# Altium project PCB_Project.PrjPcb
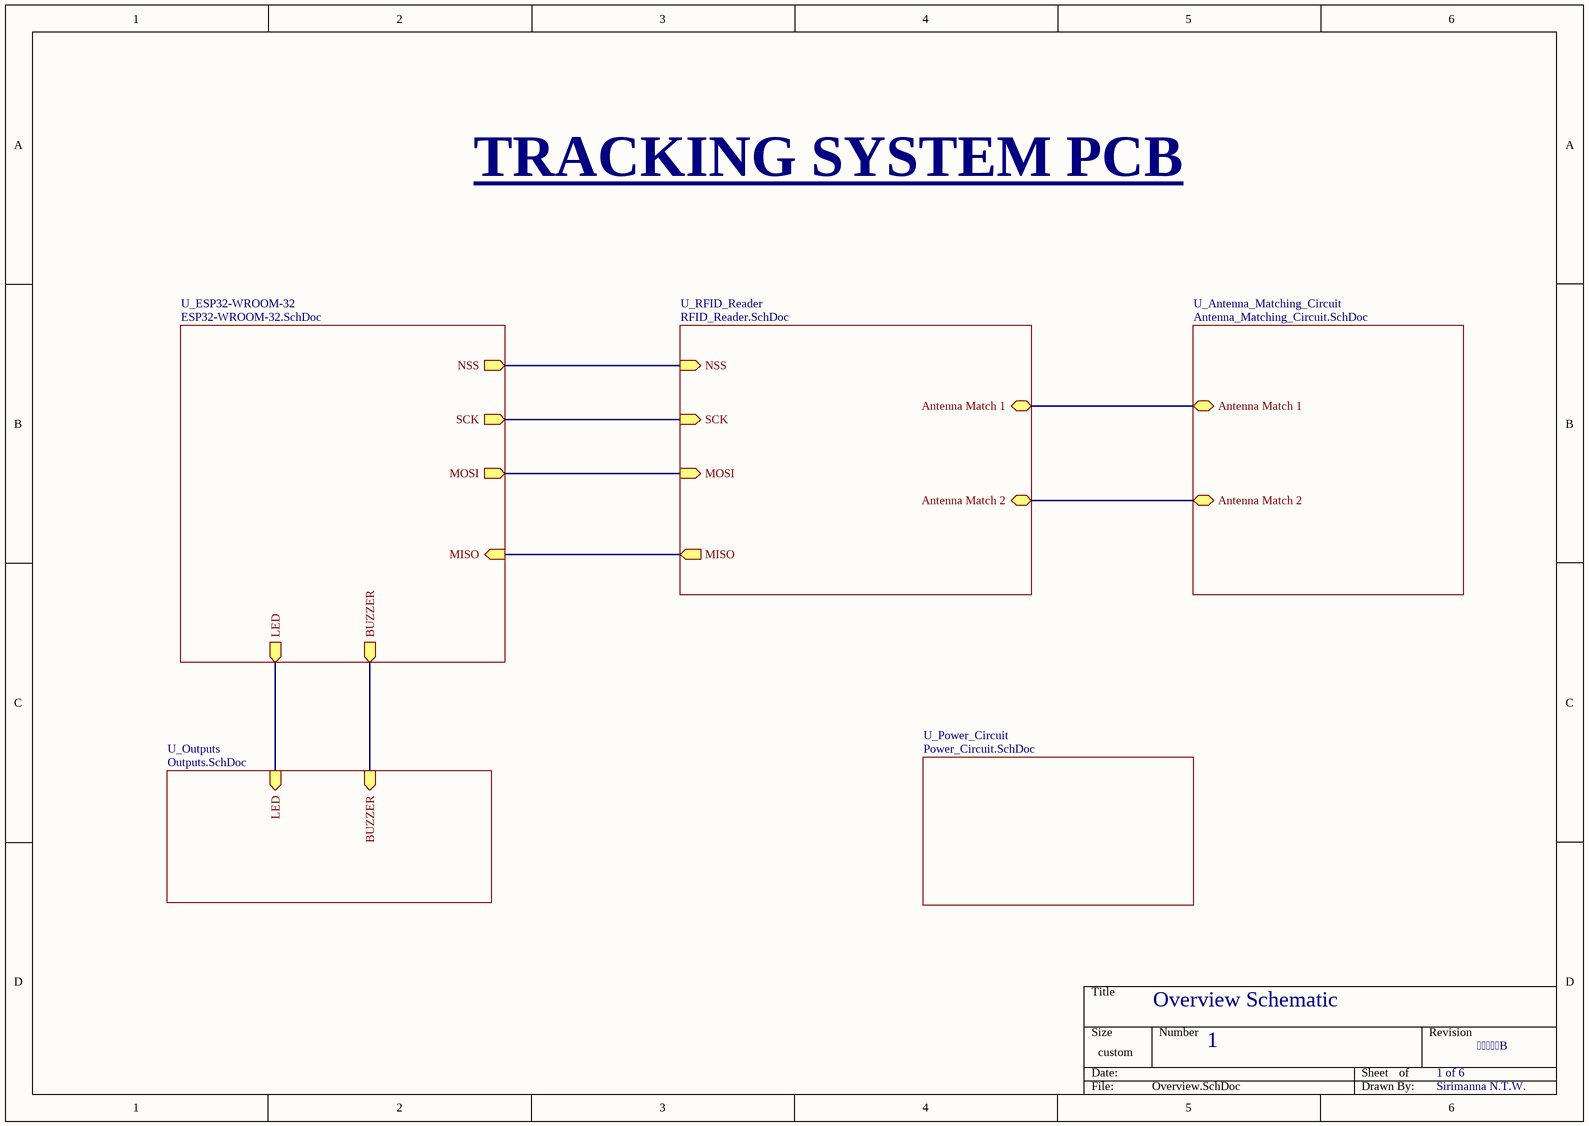
[diagram p0: Overview.SchDoc]
6 sheets, 73 parts. Net scope: hierarchical (ports join the sheet entries above them; power ports are global).
Board file: RFID_withESP32_PCB.PcbDoc
Sheets:
  Overview.SchDoc
    U_Power_Circuit = Power_Circuit.SchDoc
    U_ESP32-WROOM-32 = ESP32-WROOM-32.SchDoc
    U_Outputs = Outputs.SchDoc
    U_RFID_Reader = RFID_Reader.SchDoc
    U_Antenna_Matching_Circuit = Antenna_Matching_Circuit.SchDoc

## Sheet Overview.SchDoc
size 297 x 209 mm; SheetNumber: 1; SheetTotal: 6

### Sub-sheets
U_Antenna_Matching_Circuit = Antenna_Matching_Circuit.SchDoc: Antenna Match 1 (bidir), Antenna Match 2 (bidir)
U_ESP32-WROOM-32 = ESP32-WROOM-32.SchDoc: SCK (out), MISO (in), MOSI (out), NSS (out), BUZZER (out), LED (out)
U_Outputs = Outputs.SchDoc: BUZZER (in), LED (in)
U_Power_Circuit = Power_Circuit.SchDoc: no entries
U_RFID_Reader = RFID_Reader.SchDoc: Antenna Match 1 (bidir), Antenna Match 2 (bidir), NSS (in), SCK (in), MOSI (in), MISO (out)

### Nets
NetC20_1: sheet U_RFID_Reader/Antenna Match 1, sheet U_Antenna_Matching_Circuit/Antenna Match 1
NetC25_1: sheet U_RFID_Reader/Antenna Match 2, sheet U_Antenna_Matching_Circuit/Antenna Match 2
NetD3_2: sheet U_ESP32-WROOM-32/LED, sheet U_Outputs/LED
NetMD1_13: sheet U_ESP32-WROOM-32/BUZZER, sheet U_Outputs/BUZZER
NetMD1_29: sheet U_ESP32-WROOM-32/NSS, sheet U_RFID_Reader/NSS
NetMD1_30: sheet U_ESP32-WROOM-32/SCK, sheet U_RFID_Reader/SCK
NetMD1_31: sheet U_ESP32-WROOM-32/MISO, sheet U_RFID_Reader/MISO
NetMD1_37: sheet U_ESP32-WROOM-32/MOSI, sheet U_RFID_Reader/MOSI

### Notes on the sheet
- TRACKING SYSTEM PCB
- Overview Schematic
- 1
- 1 of 6
- B
- Sirimanna N.T.W.

## Sheet Power_Circuit.SchDoc
size 297 x 209 mm; SheetNumber: 2; SheetTotal: 6
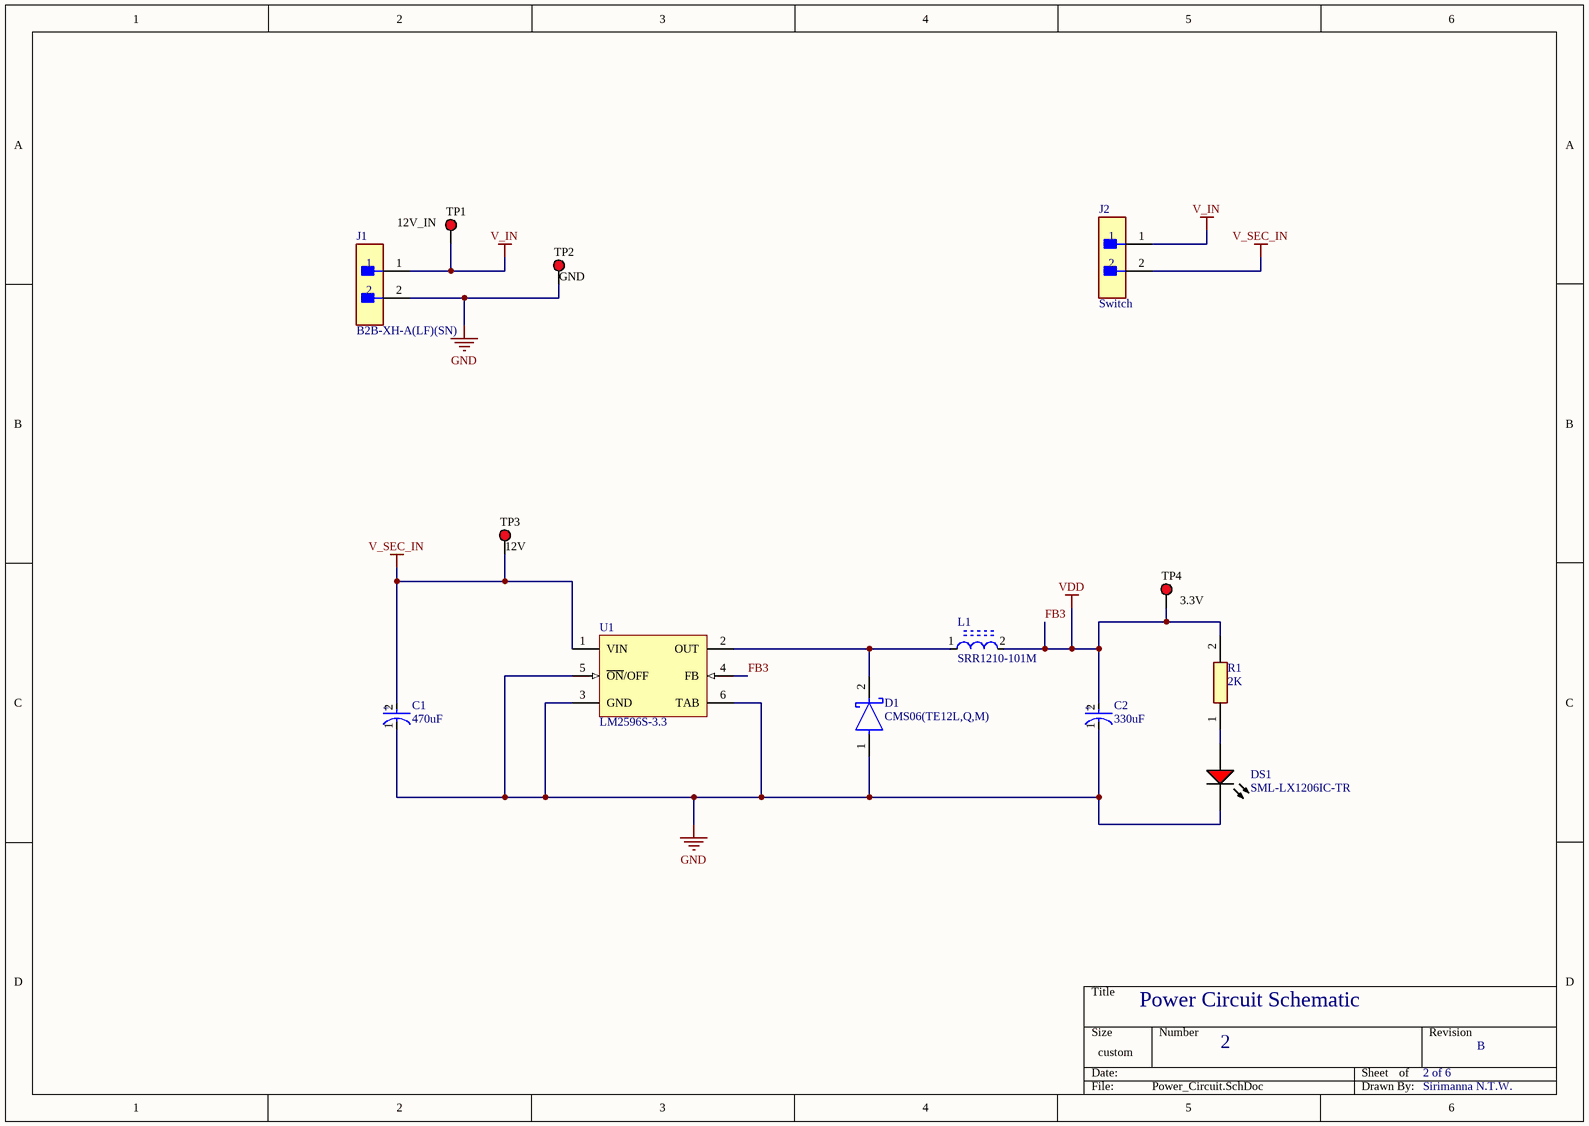
[diagram p1: Power_Circuit.SchDoc]

### Parts
C1  470uF  [FP-ZAG-MFG]
C2  330uF  [FP-FKG-MFG]
D1  CMS06(TE12L,Q,M)  [FP-M-FLAT-MFG]
DS1  SML-LX1206IC-TR  [LUMX-SML-LX1206IC_V]
J1  B2B-XH-A(LF)(SN)  [FP-B2B-XH-A_LF_SN-MFG]
J2  Switch  [FP-B2B-XH-A_LF_SN-MFG]
L1  SRR1210-101M  [FP-SRR1210-MFG]
R1  2K  [RESC3216X75N]
TP1  12V_IN  [KSTN-5010_V]
TP2  GND  [KSTN-5010_V]
TP3  12V  [KSTN-5010_V]
TP4  3.3V  [KSTN-5010_V]
U1  LM2596S-3.3  [KTT0005B_N]

### Nets
FB3: C2.2(A) L1.2 R1.2 TP4.1 U1.4(FB)  [also labelled VDD]
GND: C1.1(C) C2.1(C) D1.1(A) DS1.2(K) J1.2 TP2.1 U1.3(GND) U1.5(~{ON}/OFF) U1.6(TAB)
V_IN: J1.1 J2.1 TP1.1
V_SEC_IN: C1.2(A) J2.2 TP3.1 U1.1(VIN)
NetD1_2: D1.2(C) L1.1 U1.2(OUT)
NetDS1_1: DS1.1(A) R1.1

### Notes on the sheet
- Power Circuit Schematic
- 2
- 2 of 6
- B
- Sirimanna N.T.W.
- (in symbol CMP-2000-06221-2) +
- (in symbol CMP-05427-002115-1) +

### Library data of the parts
C1 = CMP-2000-06221-2: CAP ALUM POLY HYB 100UF 50V SMD; Manufacturer: Panasonic; Manufacturer Part Number: EEHZA1H101P; Material: Conductive Polymer; Tolerance: 20%; Dissipation Factor: 10%; Ripple Current: 2000mA; Life: 10000Hours; Esr: 28mΩ; Automotive Grade: Grade 2; Leakage Current: 50uA; Mouser Description: Cap Aluminum Polymer Hybrid 100uF 50VDC 20% (10 X 10.2mm) SMD 0.028 Ohm 2000mA 10000h 105C Embossed T/R; Automotive: Yes; Device Class L1: Passive Components; Voltage: 50V; Voltage Rating: 50V; ComponentLink2URL: https://industrial.panasonic.com/cdbs/www-data/pdf/RDD0000/ABA0000C1221.pdf; Mounting Type: Surface Mount; ComponentLink2Description: Datasheet; Temperature: -55°C to +105°C; RoHS: TRUE; Package: ZAG; Digikey Description: CAP ALUM POLY HYB 100UF 50V SMD; Temperature Range High: +105°C; Category: Cap; Height: 10.5mm; Value: 100uF; Device Class L2: Capacitors; Capacitance: 100uF; Lead Free: Yes; Temperature Range Low: -55°C; Footprint Url: https://industrial.panasonic.com/cdbs/www-data/pdf/RDD0000/DMD0000COL4.pdf; Device Class L3: Polymer Capacitors; Octopart: https://octopart.com/eeh-za1h101p-panasonic-22287466
C2 = CMP-05427-002115-1: CAP ALUM 330UF 20% 35V SMD; ESR (Equivalent Series Resistance): 80mR; Ripple Current: 850mA; Dielectric Material: Aluminium; Lead Length: 3.5mm; Life (Hours): 2000Hour; Leakage Current: 115.5uA; Length: 10.2mm; Construction: Cylindrical; Package Quantity: 500; Termination: SMD/SMT; RoHS Compliant: Yes; Impedance: 80mR; Width: 10.3mm; Height - Seated (Max): 0.402inch; Voltage: 35V; Voltage Rating: 35V; Diameter: 10mm; Contact Plating: Tin; Number of Pins: 2; Capacitance: 330uF; Case/Package: Radial; Reach SVHC Compliant: Yes; Lead Free: Lead Free; Series: FK; Ripple Current (AC): 850mA; Tolerance: 20%; Ratings: AEC-Q200; Lead Pitch: 4.6mm; Mount: Surface Mount; Height: 10.2mm; Max Operating Temperature: 105°C; Packaging: Tape and Reel; Min Operating Temperature: -55°C; Voltage Rating (DC): 35V; Radiation Hardening: No
D1 = CMP-2000-06115-2: DIODE SCHOTTKY 30V 2A MFLAT; Forward Voltage: 370mV; Peak Non-Repetitive Surge Current: 40A; Max Reverse Leakage Current: 3mA; Element Configuration: Single; Package Quantity: 1; Max Operating Temperature: 125°C; Mount: Surface Mount; Max Repetitive Reverse Voltage (Vrrm): 30V; Forward Current: 2A; Number of Pins: 2; Min Operating Temperature: -40°C; Radiation Hardening: No; Average Rectified Current: 2A; Contact Plating: Tin; Max Reverse Voltage (DC): 30V; Peak Reverse Current: 3mA; Max Surge Current: 40A; Packaging: Tape and Reel
DS1 = CMP-2000-07123-1: LED Red, 65 mW, -40 to 85 degC, 2-Pin SMD, RoHS, Tape and Reel; Manufacturer: Lumex; LED Material: GaAsP; Peak Wavelength: 635nm; Number of LEDs: 1; Viewing Angle: 160; Reverse Voltage: 5(Min)V; Lens Appearance: ColorlessNonDiffused; Intensity: 6mcd; Type: Uni-Color; Pin_Count: 2; Lens Dimensions: 2x1.6x0.5mm; Mounting: SurfaceMount; ECCN: EAR99; RoHS: Unknown; Package Description: 2-Pin Surface Mount Device, Body 3.2 x 1.5 mm; Mounting Technology: SurfaceMount; Dominant Wavelength: N/A; Supplier_Package: SMD; Supplier Standard Pack: 3,000; Color: Red; Dimension: 3.2x1.6x1.1mm; HTS: 8541402000; Part No: SML-LX1206IC-TR; Family: SML-LX1206IC; Supplier: Lumex; Datasheet URL: http://www.lumex.com/content/files/ProductAttachment/SML-LX1206IC-TR.pdf; Package Reference: SML-LX1206IC; Manufacturer URL: http://www.lumexinstruments.com/; Operating Temperature: -25to85C; Packaging: TapeandReel; Datasheet Version: Rev. J, 08/2012
J1 = CMP-2000-05888-3: CONN HEADER VERT 2POS 2.5MM; Current Rating: 3A; Voltage Rating: 250V; Number of Contacts: 2; Contact Resistance: 20mR; Wire/Cable Gauge: 22AWG; Insulation Resistance: 1GR; Connector Type: Male Pin; Packaging: Bulk; Contact Material: Brass; Lead Free: Lead Free; Orientation: Straight; Contact Plating: Tin; Max Current Rating: 3A; Termination: Solder; Fastening Type: Detent; Depth: 5.75mm; Housing Material: Polyamide; REACH SVHC: No SVHC; Series: XH; Voltage Rating (AC): 250V; Number of Positions: 2; Color: Natural; Contact Type: Male Pin; Max Voltage Rating (DC): 250V; Pitch: 2.5mm; Lead Pitch: 2.5mm; Mount: Through Hole; Max Operating Temperature: 85°C; Length: 7.4mm; Max Voltage Rating (AC): 250V; Min Operating Temperature: -25°C; Number of Rows: 1; Housing Color: White
J2 = CMP-2000-05888-3: To power Switch; Current Rating: 3A; Voltage Rating: 250V; Number of Contacts: 2; Contact Resistance: 20mR; Wire/Cable Gauge: 22AWG; Insulation Resistance: 1GR; Pitch: 2.5mm; Connector Type: Male Pin; Packaging: Bulk; Contact Material: Brass; Lead Free: Lead Free; Orientation: Straight; Contact Plating: Tin; Max Current Rating: 3A; Termination: Solder; Fastening Type: Detent; Depth: 5.75mm; Housing Material: Polyamide; REACH SVHC: No SVHC; Series: XH; Voltage Rating (AC): 250V; Number of Positions: 2; Color: Natural; Contact Type: Male Pin; Max Voltage Rating (DC): 250V; Lead Pitch: 2.5mm; Mount: Through Hole; Max Operating Temperature: 85°C; Length: 7.4mm; Max Voltage Rating (AC): 250V; Min Operating Temperature: -25°C; Number of Rows: 1; Housing Color: White
L1 = CMP-07248-000065-1: FIXED IND 100UH 2.5A 135MOHM SMD; Shielding: Shielded; DC Resistance (DCR): 135mR; Core Material: Ferrite; Inductance Tolerance: 20%; Saturation Current: 2.2A; Q Factor: 16; Self Resonant Frequency: 3MHz; Test Frequency: 100kHz; Height: 10mm; Width: 0.472inch; Mount: Surface Mount; Inductance: 100uH; RMS Current (Irms): 2.5A; Packaging: Tape and Reel; Max Operating Temperature: 125°C; Military Standard: Not; DC Current: 2.5A; Max DC Current: 2.5A; Length: 12mm; RoHS Compliant: Yes; Height - Seated (Max): 0.394inch; Resistor Type: Wirewound; Current Rating: 2.5A; REACH SVHC: No SVHC; Tolerance: 20%; Series: SRR1210; Package Quantity: 1; Min Operating Temperature: -40°C; Depth: 12.5mm; Case/Package: 1210; Termination: SMD/SMT
R1 = CR1206-FX-1022ELF: Resistor; Manufacturer_Name: Bourns; Datasheet Link: http://componentsearchengine.com/Datasheets/1/CR1206-FX-1022ELF.pdf; Height: 0.75mm; Manufacturer_Part_Number: CR1206-FX-1022ELF; Mouser Part Number: 652-CR1206FX-1022ELF; Mouser Price/Stock: https://www.mouser.co.uk/ProductDetail/Bourns/CR1206-FX-1022ELF?qs=3wWX5hyYeeRJQVfgTvfo2Q%3D%3D; Arrow Part Number: CR1206-FX-1022ELF; Arrow Price/Stock: https://www.arrow.com/en/products/cr1206-fx-1022elf/bourns
TP1-TP4 = CMP-1672-00002-4: Test Point, Red, Through Hole, RoHS, Bulk; Manufacturer: Keystone; Contact Material: Bronze; Mounting Technology: Through Hole; RoHSCompliant: true; Pins: 1; Package Quantity: 100; ComponentLink2Description: Datasheet; Height: 8.12 mm; ComponentLink1URL: http://www.keyelco.com/; DatasheetVersion: Rev. F, 12/2013; Mount: Through Hole; PackageReference: 5010; Contact Plating: Silver; Packaging: Bulk; Colour: Red; REACH SVHC: No SVHC; PackageDescription: 1-Pin Through Hole Device, Dia 3.17 mm; ComponentLink2URL: http://www.keyelco.com/product-pdf.cfm?p=1319; ComponentLink1Description: Manufacturer URL
U1 = CMP-0069-00276-3: SIMPLE SWITCHER® Power Converter 150 KHz 3A Step-Down Voltage Regulator, 5-pin TO-263; Manufacturer: Texas Instruments; PowerWise: N; PackageTopMarking: NSUZXYTTE#*LM2596S*-3.3 P+; ComponentLink1Description: Datasheet URL; RoHS: N; PackageDescription: TO-263, Molded, .400 x .390 x .180in, 5 Lead, .067in Pitch, Surface Mount; PackageReference: KTT0005B; Code_JEDEC: MO-169-AB; PinCount: 5; ComponentLink1URL: http://www.ti.com/general/docs/lit/getliterature.tsp?genericPartNumber=LM2596&fileType=pdf; CompType: Switcher

## Sheet ESP32-WROOM-32.SchDoc
size 297 x 209 mm; SheetNumber: 3; SheetTotal: 6
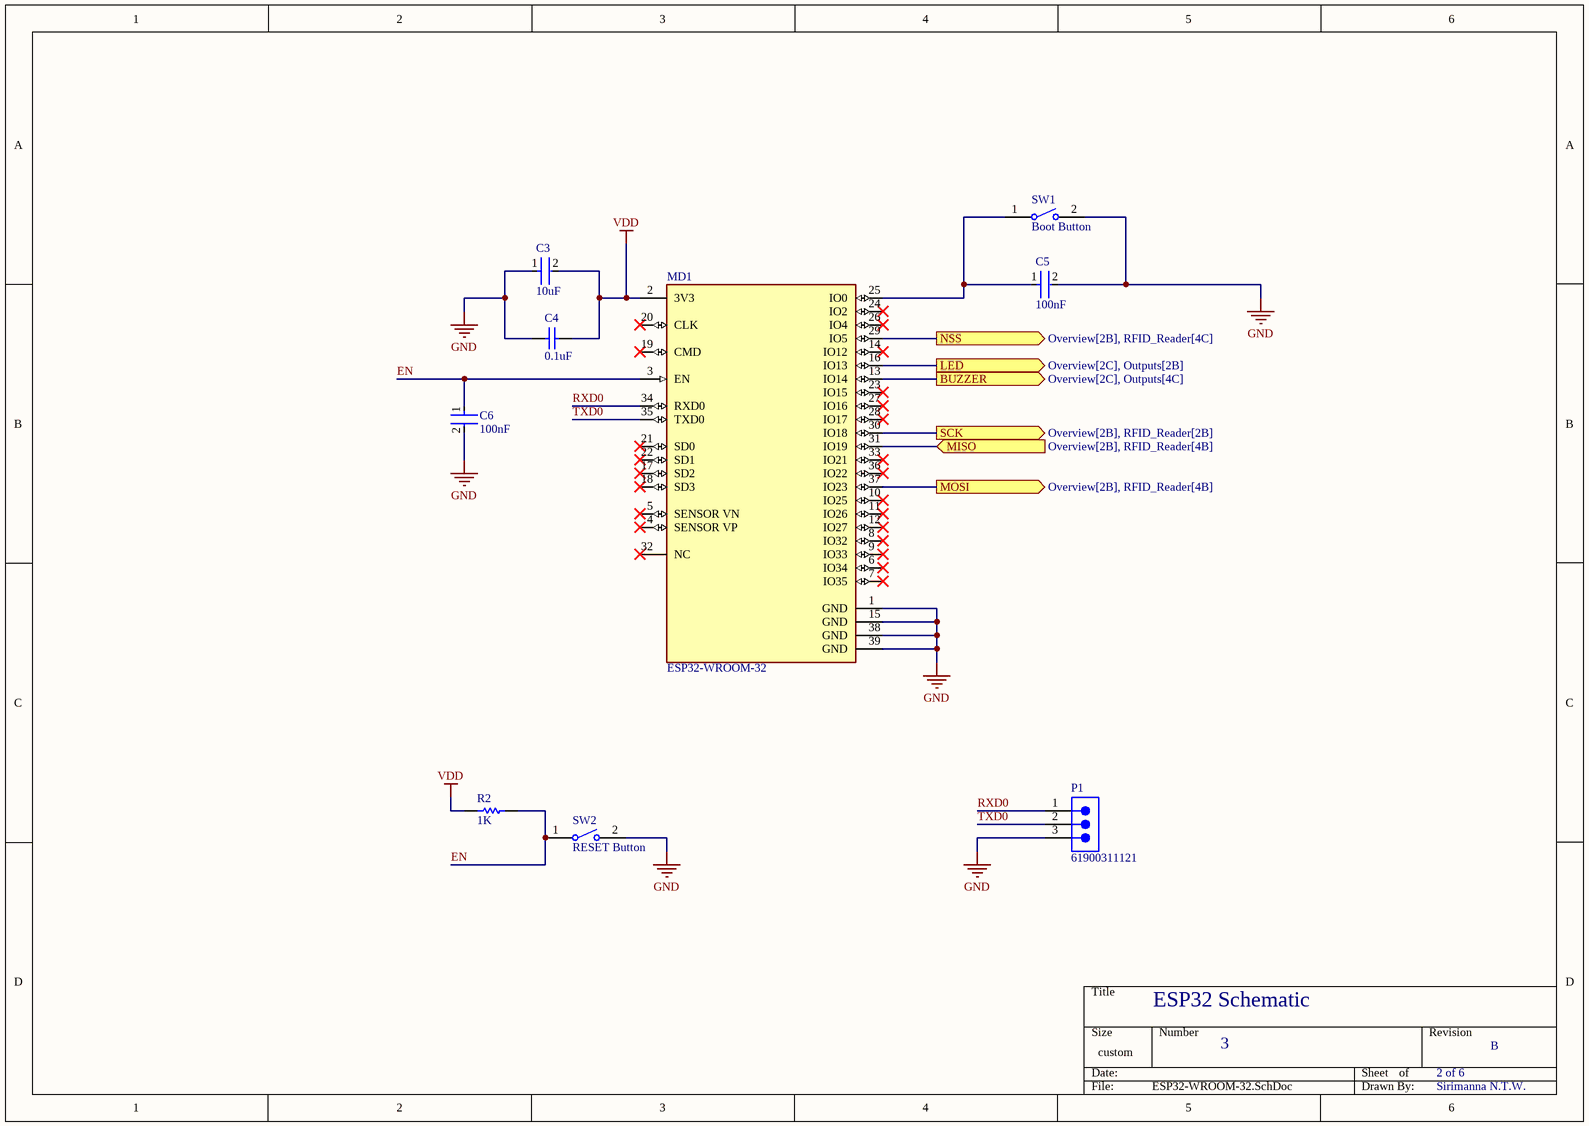
[diagram p2: ESP32-WROOM-32.SchDoc]

### Parts
C3  10uF  [FP-C0805C-DG-MFG]
C4  0.1uF  [CAPC2013X94X50ML20T25]
C5  100nF  [FP-CC0805-0_85-MFG]
C6  100nF  [FP-0805-L_2_01_0_2-W_1_25-IPC_B]
MD1  ESP32-WROOM-32  [FP-ESP32-WROOM-32-MFG]
P1  61900311121  [61900311121]
R2  1K  [RESC2013X60X35ML10T20]
SW1  Boot Button  [TECO-FSMSM-2_V]
SW2  RESET Button  [TECO-FSMSM-2_V]

### Ports
BUZZER (out, see Overview[2C], Outputs[4C]), LED (out, see Overview[2C], Outputs[2B]), MISO (in, see Overview[2B], RFID_Reader[4B]), MOSI (out, see Overview[2B], RFID_Reader[4B]), NSS (out, see Overview[2B], RFID_Reader[4C]), SCK (out, see Overview[2B], RFID_Reader[2B])

### Nets
GND: C3.1 C4.1 C5.2 C6.2 MD1.1(GND) MD1.15(GND) MD1.38(GND) MD1.39(GND) P1.3 SW1.2 SW2.2
VDD: C3.2 C4.2 MD1.2(3V3) R2.1  [project net FB3]
EN: C6.1 MD1.3(EN) R2.2 SW2.1
RXD0: MD1.34(RXD0) P1.1
TXD0: MD1.35(TXD0) P1.2
NetC5_1: C5.1 MD1.25(IO0) SW1.1
NetD3_2: MD1.16(IO13) ; port LED
NetMD1_13: MD1.13(IO14) ; port BUZZER
NetMD1_29: MD1.29(IO5) ; port NSS
NetMD1_30: MD1.30(IO18) ; port SCK
NetMD1_31: MD1.31(IO19) ; port MISO
NetMD1_37: MD1.37(IO23) ; port MOSI

Not connected (* = marked no-connect by the designer): MD1 4(SENSOR_VP)* 5(SENSOR_VN)* 6(IO34)* 7(IO35)* 8(IO32)* 9(IO33)* 10(IO25)* 11(IO26)* 12(IO27)* 14(IO12)* 17(SD2)* 18(SD3)* 19(CMD)* 20(CLK)* 21(SD0)* 22(SD1)* 23(IO15)* 24(IO2)* 26(IO4)* 27(IO16)* 28(IO17)* 32(NC)* 33(IO21)* 36(IO22)*

### Notes on the sheet
- ESP32 Schematic
- 3
- 2 of 6
- B
- Sirimanna N.T.W.

### Library data of the parts
C3 = CMP-2007-03243-2: CAP CER 10UF 10V X5R 0805; Manufacturer Part Number: C0805C106K8PACTU; Manufacturer: Kemet; 3DS Part Number: 220-00001; Tolerance: 10%; Temperature Coefficient: 15%; Material: Ceramic; Device Class L2: Capacitors; Device Class L1: Passive Components; ComponentLink2URL: https://content.kemet.com/datasheets/KEM_C1006_X5R_SMD.pdf; Height: 1.4mm; Lead Free: Yes; Digikey Description: CAP CER 10UF 10V X5R 0805; Octopart: https://octopart.com/c0805c106k8pactu-kemet-98697; Capacitance: 10uF; Value: 10uF; Temperature Range Low: -55°C; Temperature: -55°C to +85°C; Automotive: No; Mouser Description: CAP CER 10UF 10V X5R 0805; Ipc Land Pattern Name: CAPC200125X125; Temperature Range High: +85°C; Voltage: 10V; RoHS: TRUE; Device Class L3: Ceramic Capacitors; ComponentLink2Description: Datasheet; Voltage Rating: 10V; Package: C0805C-DG; Temperature Characteristic: X5R; Category: Cap
C4 = CMP-1036-04427-2: Manufacturer: AVX Interconnect / Elco; Part Number: 08051C104JAT2A
C5 = CMP-2100-03606-3: CAP CER 0.1UF 50V X7R 0805; Manufacturer Part Number: CC0805KRX7R9BB104; Manufacturer: Yageo; Tolerance: 0.1; Material: Ceramic; Device Class L1: Passive Components; ComponentLink2Description: Datasheet; Package: CC0805-0.85; Digikey Description: CAP CER 0.1UF 50V X7R 0805; Capacitance: 100 nF; Device Class L3: Ceramic Capacitors; Value: 100 nF; Temperature: -30°C to +85°C; Temperature Characteristic: X7R; Voltage Rating: 50 V; Height: 0.95mm; RoHS: TRUE; Ipc Land Pattern Name: CAPC200125X85; Device Class L2: Capacitors; Category: Cap; Temperature Range Low: -30°C; Temperature Range High: +85°C; Mouser Description: Multilayer Ceramic Capacitors MLCC - SMD/SMT 100nF 50V X7R 10%; Footprint Url: http://www.yageo.com/exep/pages/download/literatures/UPY-C_GEN_24.pdf; Automotive: No; Octopart: https://octopart.com/cc0805krx7r9bb104-yageo-192993; Lead Free: Yes; ComponentLink2URL: http://www.yageo.com/documents/recent/UPY-GPHC_Y5V_6.3V-to-50V_8.pdf
C6 = CMP-2007-04174-2: General Purpose Ceramic Capacitor, 0805, 100nF, 10%, X7R, 15%, 100V; Packaging: Tape and Reel; Min Operating Temperature: -55°C; Dielectric Material: Ceramic; Height: 1.4mm; Voltage Rating: 100V; Termination: SMD/SMT; Case Code (Imperial): 0805; Case Code (Metric): 2012; Case/Package: 0805; Construction: Flat; Radiation Hardening: No; Series: -; Dielectric: X7R; Package Quantity: 2000; Mount: Surface Mount; Capacitance: 100nF; Contact Plating: Tin; Voltage: 100V; Lead Free: Lead Free; Depth: 1.25mm; RoHS Compliant: Yes; Number of Pins: 2; Max Operating Temperature: 125°C; Length: 2.01mm; Voltage Rating (DC): 100V; Thickness: 0.055inch; REACH SVHC: No SVHC; Width: 0.049inch; Tolerance: 10%
MD1 = CMP-194065-000008-1: RX TXRX MOD WIFI SURFACE MOUNT; Frequency: 2.5GHz; Sensitivity: -98dBm; Operating Supply Voltage: 3.6V; Data Rate: 150Mbps; Weight: 0.088185oz; Package Quantity: 550; Min Operating Temperature: -40°C; Mount: Surface Mount; Max Operating Temperature: 85°C; Packaging: Cut Tape; Case/Package: SMD/SMT
P1 = CMP-1502-00585-2: NexarPartId: 18818222; Current Rating: 3A; Voltage Rating: 250V; Number of Positions: 3; Insulation Resistance: 1GΩ; Gender: Male; Pitch: 2.54mm; Connector Type: Male Pin; Contact Resistance: 20mΩ; Termination: Through Hole; Width: 7.66mm; Contact Plating: Tin; Orientation: Vertical; Mount: Through Hole; Contact Gender: Male; Max Operating Temperature: 105°C; Length: 7.62mm; Number of Rows: 1; Height: 12.5mm; Lead Pitch: 2.54mm; Housing Material: Nylon; Color: Beige; Contact Material: Copper; Fastening Type: Friction; Min Operating Temperature: -40°C; Number of Contacts: 3; Number of Pins: 3; Flammability Rating: UL94 V-0; Contact Mating Length: 7.493mm; RoHS: Compliant; REACH SVHC: Unknown; Packaging: Bulk; Operating Supply Voltage: 250V
R2 = CMP-2100-03671-1: Chip Resistor, 1 KOhm, +/- 1%, 125 mW, -55 to 155 degC, 0805 (2012 Metric), RoHS, Tape and Reel; Manufacturer: Yageo; Temperature Coefficient: 100ppm/degreesC; Voltage Rating (DC): 150V; Max Power Dissipation: 125mW; Resistance: 1KOhm; Number of Pins: 2; Number of Terminations: 2; Datasheet URL: http://www.yageo.com/NewPortal/yageodocoutput?fileName=/pdf/R-Chip/PYu-RC_Group_51_RoHS_L_5.pdf; Length: 0.079inch; Package Description: 2-Pin Surface Mounted Device, Body 2 x 1.25 mm; Depth: 1.25mm; Height: 0.024inch; Military Standard: Not; Case/Package: 0805; Package Reference: 0805; RoHSCompliant: true; Lead Free: LeadFree; Packaging: TapeandReel; Package Quantity: 1; Datasheet Version: Rev. 5, 10/2016; Tolerance: 1%; Min Operating Temperature: -55degC; Voltage Rating: 150V; Composition: ThickFilm; Case Code (Imperial): 0805; Power Rating: 125mW; Width: 0.049inch; Case Code (Metric): 2012; Manufacturer URL: http://www.yageo.com/; Max Operating Temperature: 155degC; REACH SVHC: Unknown; Termination: SMD/SMT
SW1 SW2 = CMP-2000-07511-1: FSMSM Push Button Switch, 50 mA, -35 to 85 degC, 2-Pin SMD, RoHS, Bulk; Manufacturer: TE Connectivity; Actuator Length: 1.07mm; Electrical Life: 20000Cycles; Actuator Material: Polyamide; Current Rating: 50mA; Illumination Type: Illuminated; Voltage Rating (DC): 24V; Contact Resistance: 100mOhm; Case\/Package: SMD/SMT; Operating Force: 180gf; Switch Travel: 0.25mm; Max Voltage Rating (DC): 12V; Throw Configuration: SPST; Packaging: LoosePiece; Max Operating Temperature: 85degC; ELV: Compliant; Package Description: 2-Pin Surface Mount Device, Body 6 x 3.5 mm, Pitch 9.19 mm; RoHSCompliant: true; Manufacturer URL: http://www.te.com/; Contact Plating: Silver; Contact Material: Brass; Mounting Technology: SurfaceMount; Contact Current Rating: 50mA; Datasheet Version: Rev. C2, 08/2014; Datasheet URL: http://www.te.com/commerce/DocumentDelivery/DDEController?Action=showdoc&DocId=Customer+Drawing%7F1437566-3%7FC2%7Fpdf%7FEnglish%7FENG_CD_1437566-3_C2_1437566_3_1_c.dwg.pdf%7F1437566-3; Mechanical Life: 20000Cycles; Package Reference: FSMSM; REACH SVHC: Unknown; Orientation: Straight; Min Operating Temperature: -35degC; Lead Free: LeadFree; Termination: GullWing; Package Quantity: 1000; Mount: SurfaceMount

## Sheet Outputs.SchDoc
size 297 x 209 mm; SheetNumber: 6; SheetTotal: 6
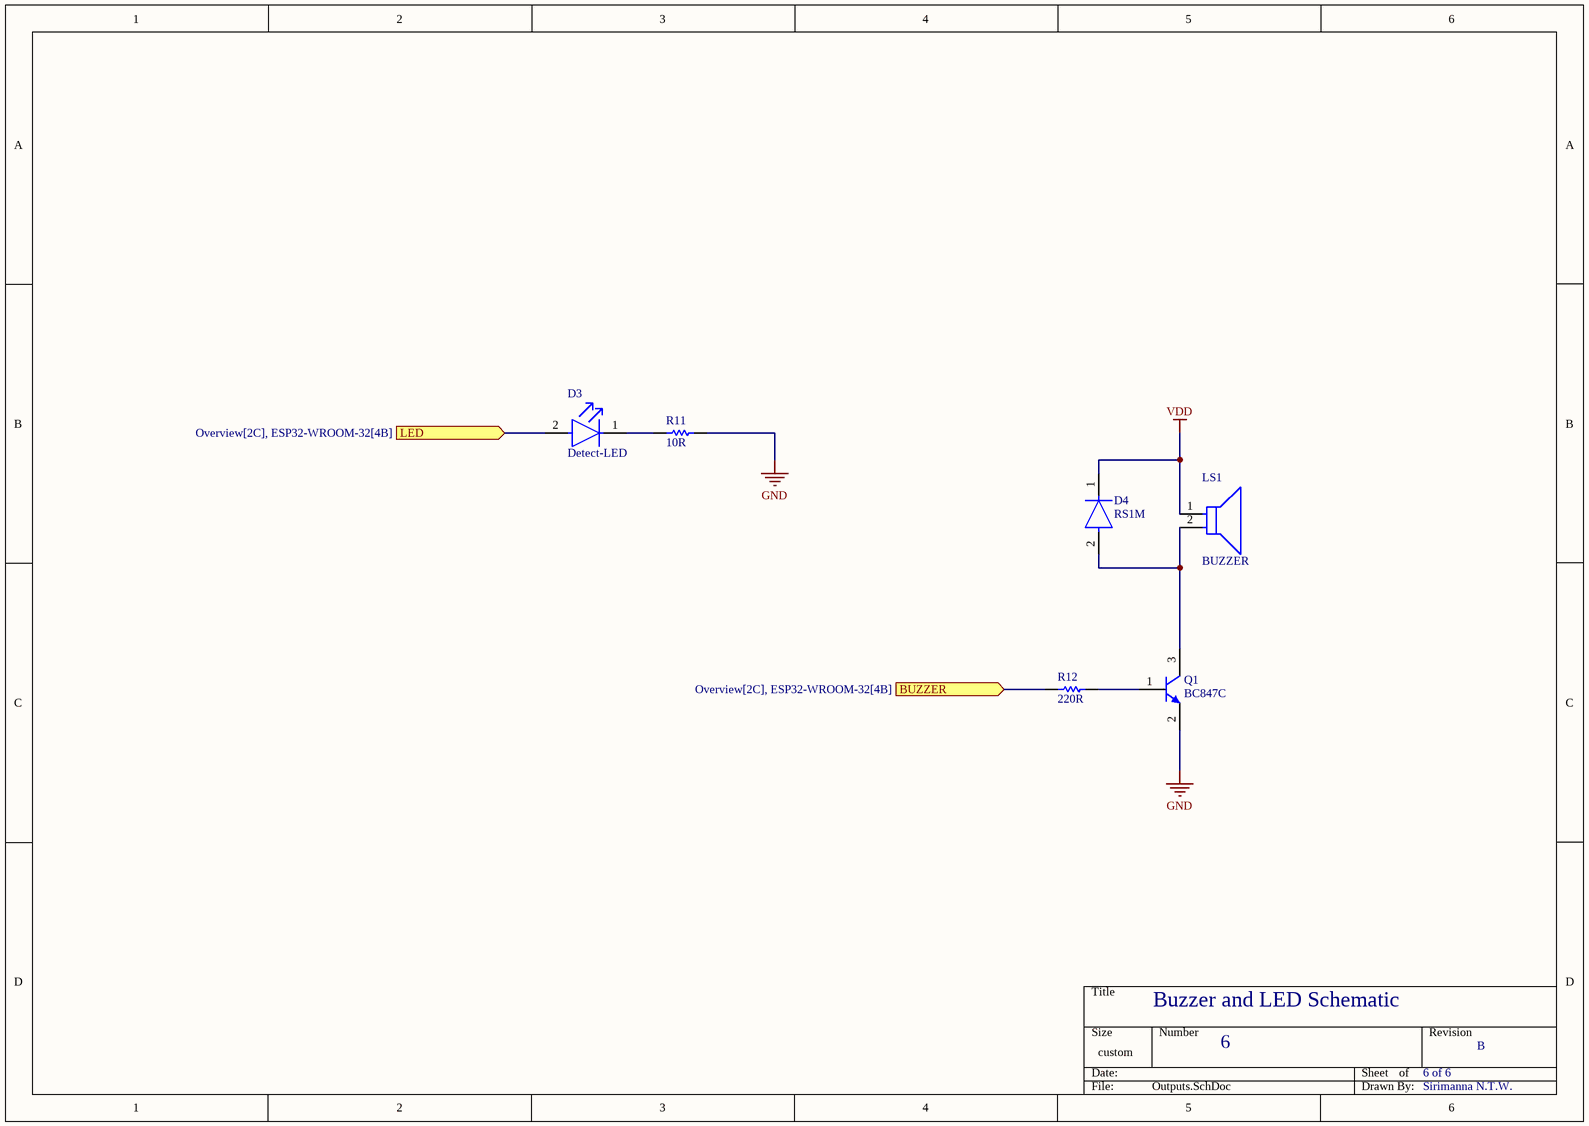
[diagram p3: Outputs.SchDoc]

### Parts
D3  Detect-LED  [FP-6_544-5255_01-4-MFG]
D4  RS1M  [FP-403AE-MFG]
LS1  BUZZER  [FP-PS1440P02BT-MFG]
Q1  BC847C  [INF-SOT23_M]
R11  10R  [RESC2013X60X35ML10T20]
R12  220R  [RESC2013X70X40LL20T20]

### Ports
BUZZER (in, see Overview[2C], ESP32-WROOM-32[4B]), LED (in, see Overview[2C], ESP32-WROOM-32[4B])

### Nets
GND: Q1.2(E) R11.2
VDD: D4.1(C) LS1.1  [project net FB3]
NetD3_1: D3.1(C) R11.1
NetD3_2: D3.2(A) ; port LED
NetD4_2: D4.2(A) LS1.2 Q1.3(C)
NetMD1_13: R12.1 ; port BUZZER
NetQ1_1: Q1.1(B) R12.2

### Notes on the sheet
- Buzzer and LED Schematic
- 6
- 6 of 6
- B
- Sirimanna N.T.W.

### Library data of the parts
D3 = CMP-00030-55433990-1: TLLG4400 Led, Pcb, Green, 0.63MCD, 3MM, T-1, 7MA, 1.9V, 565NM, 25DEG, 20V, 20MW, -40; Lens Transparency: Diffused; Dominant Wavelength: 575nm; Test Current: 2mA; Viewing Angle: 50°; Lens Style: Circular, Colored, Diffused, Dome, Round; Number of LEDs: 1; Voltage Rating (DC): 2.4V; Luminous Intensity: 1.2mcd; Depth: 3.2mm; Wavelength: 575nm; Color: Green; Schedule B: 8541402000, 8541402000; RoHS: Compliant; Max Operating Temperature: 100°C; Power Dissipation: 20mW; Height: 4.5mm; Number of Pins: 2; Forward Voltage: 1.9V; NexarPartId: 55433990; Max Power Dissipation: 20mW; Length: 3.2mm; Forward Current: 2mA; Min Operating Temperature: -40°C; Illumination Color: Green; Lens Size: 3mm; Reverse Voltage: 20V; Mount: Through Hole; Case/Package: T; Radiation Hardening: No; Number of Elements: 1; REACH SVHC: Unknown; Lens Color: Green
D4 = CMP-07163-000022-1: DIODE GEN PURP 1KV 1A SMA; Manufacturer: ON Semiconductor; Max Surge Forward Current: 30A; Max Repetitive Reverse Voltage: 1000V; Value: 10pF; Max Junction Temp: +150°C; Peak Reverse Current: 5uA; Standoff Height: 0.05mm; ComponentLink2URL: https://www.onsemi.com/pub/Collateral/RS1M-D.PDF; Footprint Url: https://www.onsemi.com/pub/Collateral/403AE.PDF; Mouser Description: On a Reel of 7500, ON Semi 1000V 1A, Diode, 2-Pin DO-214AC RS1M; Package: 403AE; Manufacturer Part Number: RS1M; Temperature Range Low: -55°C; Device Class L1: Discrete Semiconductors; Automotive: No; Height: 2.5mm; Octopart: https://octopart.com/rs1m-on+semiconductor-84331238; Digikey Description: DIODE GEN PURP 1KV 1A SMA; Temperature Range High: +150°C; Capacitance: 10pF; RoHS: TRUE; Device Class L2: Diodes; ComponentLink2Description: Datasheet; Temperature: -55°C to +150°C; Device Class L3: Rectifier Diodes; Forward Current: 1A; Lead Free: Yes; Category: Diode
LS1 = CMP-08413-000003-1: AUDIO PIEZO TRANSDUCER 30V TH; Self Resonant Frequency: 4kHz; Washable: No; Voltage Rating (DC): 3V; Number of Terminals/Pins: 2; Packaging: Tape and Reel; Lead Free: Lead Free; Min Operating Temperature: -10°C; Package Quantity: 350; Termination: PC Pins; Mount: Through Hole; Max Operating Temperature: 70°C; Operating Supply Voltage: 3V; Diameter: 14mm; RoHS Compliant: Yes; Frequency: 4kHz; Height: 8mm
Q1 = CMP-1177-00042-1: NPN Silicon AF Transistor, 45 V VCEO, 100 mA IC, SOT23, Reel, Green; Manufacturer: Infineon; PartNumber: BC847B; VEBO (max): 6Â V; ICBO (max): 15Â nA; VCBO (max): 50Â V; IBM (max): 200Â mA; Green: TRUE; Ptot (max): 330Â mW; fT (typ): 250Â MHz; IC (max): 100Â mA; VCEO (max): 45Â V; PackageDescription: 3-Pin Small Outline Transistor Package, 1.3 x 2.9 mm Body, 0.95 mm Pitch; ComponentLink3URL: http://www.infineon.com/dgdl/SOT23-Package_Overview.pdf?folderId=db3a30431936bc4b0119532290053c66&fileId=db3a30431936bc4b0119533468123c85; PackageVersion: Apr-08; Packing: Reel; ComponentLink3Description: Package Specification; ComponentLink2URL: http://www.infineon.com/dgdl/bc847series_bc848series_bc849series_bc850series.pdf?folderId=db3a304314dca389011541d30fa21656&fileId=db3a304314dca389011541d4630a1657; ComponentLink1URL: http://www.infineon.com/; ComponentLink2Description: Datasheet; Polarity: NPN; Mounting Technology: Surface Mount; PackageReference: SOT23; ICM (max): 200Â mA; ComponentLink1Description: Manufacturer URL
R11 = CMP-2100-03670-1: Chip Resistor, 10 Ohm, +/- 1%, 0.125 W, -55 to 155 degC, 0805 (2012 Metric), RoHS, Tape and Reel; Manufacturer: Yageo; Resistance: 10Ohm; Power Rating: 125mW; Voltage Rating: 150V; Temperature Coefficient: 200ppm/degreesC; Number of Pins: 2; REACH SVHC: NoSVHC; Datasheet Version: Rev. 5, 10/2016; Max Operating Temperature: 155degC; Manufacturer URL: http://www.yageo.com/; Case Code (Imperial): 0805; Package Description: 2-Pin Surface Mounted Device, Body 2 x 1.25 mm; Case Code (Metric): 2012; Length: 2mm; RoHSCompliant: true; Max Power Dissipation: 125mW; Depth: 1.25mm; Packaging: TapeandReel; Height: 0.5mm; Package Reference: 0805; Package Quantity: 1; Tolerance: 1%; Termination: SMD/SMT; Min Operating Temperature: -55degC; Lead Free: LeadFree; Width: 1.25mm; Voltage Rating (DC): 150V; Datasheet URL: http://www.yageo.com/NewPortal/yageodocoutput?fileName=/pdf/R-Chip/PYu-RC_Group_51_RoHS_L_5.pdf; Composition: ThickFilm; Number of Terminations: 2; Case/Package: 0805
R12 = CMP-2001-00044-1: Part Number: ERJ6ENF2200V; Manufacturer: Panasonic

## Sheet RFID_Reader.SchDoc
size 297 x 209 mm; SheetNumber: 4; SheetTotal: 6
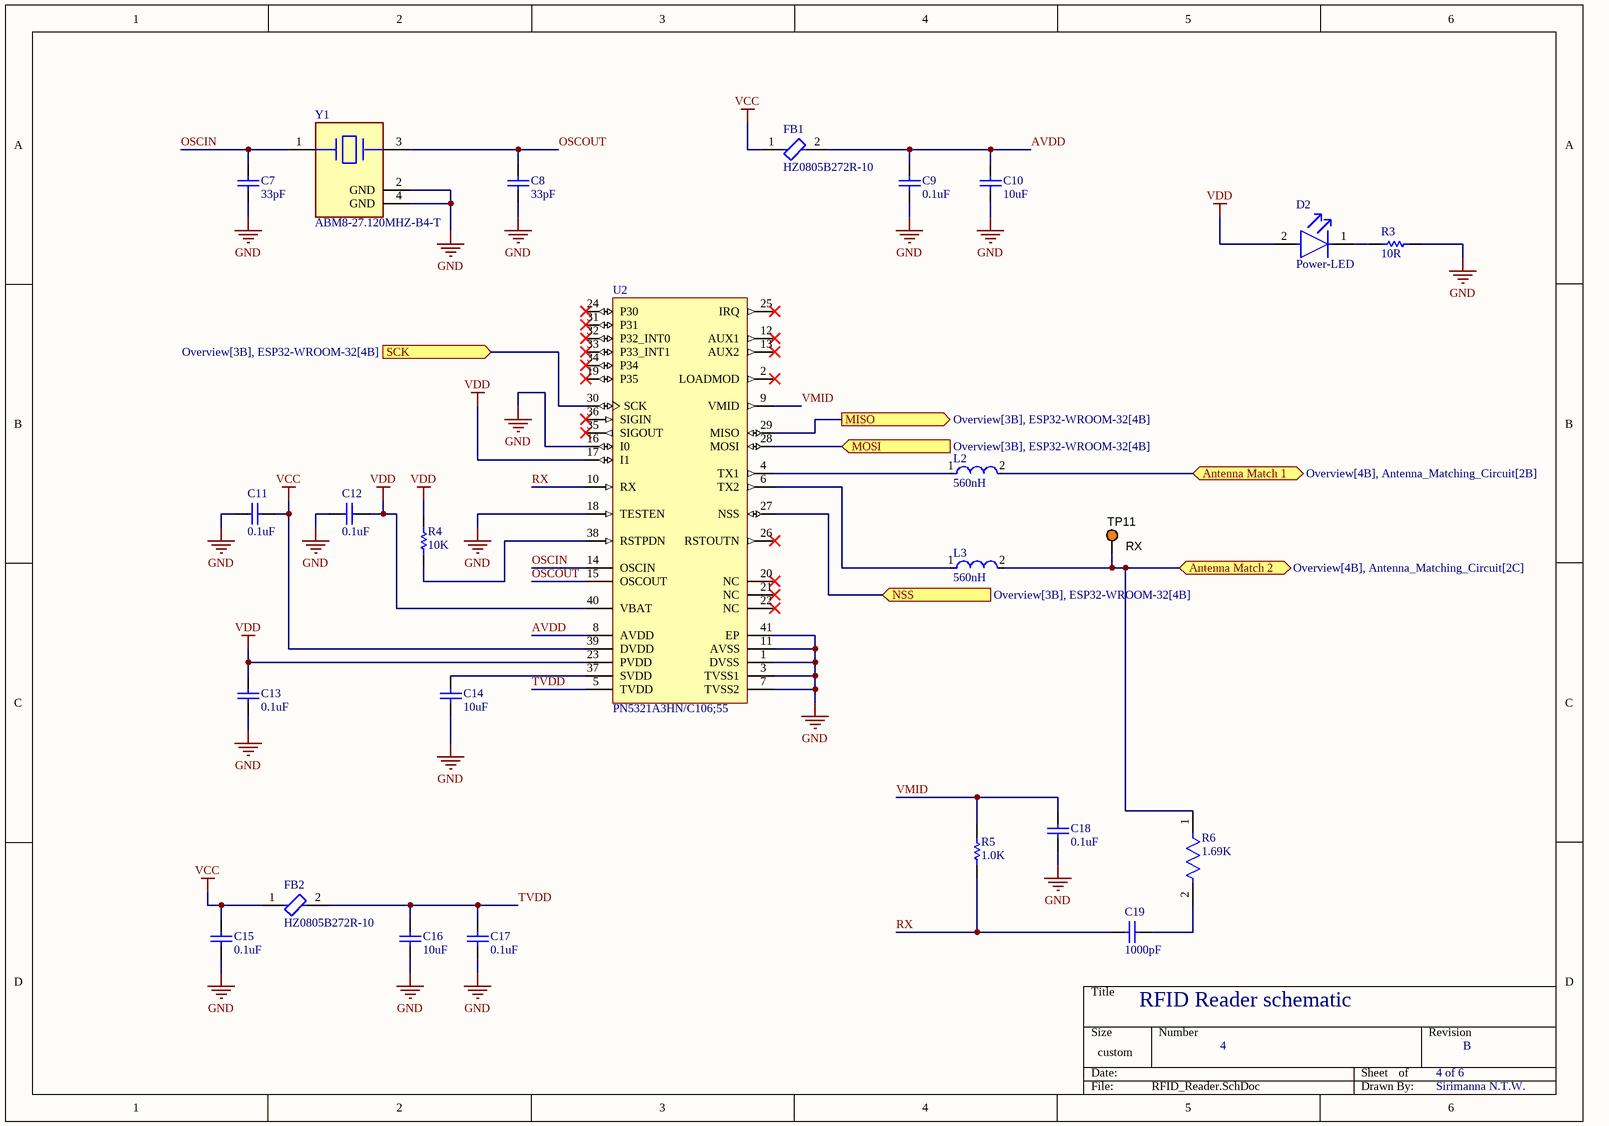
[diagram p4: RFID_Reader.SchDoc]

### Parts
C7  33pF  [CAPC2013X135X45NL10T25]
C8  33pF  [CAPC2013X135X45NL10T25]
C9  0.1uF  [CAPC2013X135X45NL10T25]
C10  10uF  [CAPC2013X135X45NL10T25]
C11  0.1uF  [CAPC2013X135X45NL10T25]
C12  0.1uF  [CAPC2013X135X45NL10T25]
C13  0.1uF  [CAPC2013X135X45NL10T25]
C14  10uF  [CAPC2013X135X45NL10T25]
C15  0.1uF  [CAPC2013X135X45NL10T25]
C16  10uF  [CAPC2013X135X45NL10T25]
C17  0.1uF  [CAPC2013X135X45NL10T25]
C18  0.1uF  [CAPC2013X135X45NL10T25]
C19  1000pF  [CAPC2013X135X45NL10T25]
D2  Power-LED  [FP-6_544-5255_01-4-MFG]
FB1  HZ0805B272R-10  [FP-MPZ2012-MFG]
FB2  HZ0805B272R-10  [FP-MPZ2012-MFG]
L2  560nH  [FP-LQM21DN_00-IPC_C]
L3  560nH  [FP-LQM21DN_00-IPC_C]
R3  10R  [RESC2013X60X35ML10T20]
R4  10K  [RESC2013X60X35NL10T20]
R5  1.0K  [RESC2013X50X30NL20T20]
R6  1.69K  [FP-CRCW0805-e3-MFG]
TP11  RX  [KSTN-5003]
U2  PN5321A3HN/C106;55  [NXP-HVQFN-40_L]
Y1  ABM8-27.120MHZ-B4-T  [FP-ABM8-MFG]

### Ports
Antenna Match 1 (bidir, see Overview[4B], Antenna_Matching_Circuit[2B]), Antenna Match 2 (bidir, see Overview[4B], Antenna_Matching_Circuit[2C]), MISO (out, see Overview[3B], ESP32-WROOM-32[4B]), MOSI (in, see Overview[3B], ESP32-WROOM-32[4B]), NSS (in, see Overview[3B], ESP32-WROOM-32[4B]), SCK (in, see Overview[3B], ESP32-WROOM-32[4B])

### Nets
GND: C7.1 C8.1 C9.1 C10.1 C11.2 C12.2 C13.1 C14.1 C15.1 C16.1 C17.1 C18.1 R3.2 U2.1(DVSS) U2.3(TVSS1) U2.7(TVSS2) U2.11(AVSS) U2.16(I0) U2.18(TESTEN) U2.41(EP) Y1.2(GND) Y1.4(GND)
VCC: C11.1 C15.2 FB1.1 FB2.1 U2.39(DVDD)
VDD: C12.1 C13.2 D2.2(A) R4.2 U2.17(I1) U2.23(PVDD) U2.40(VBAT)  [project net FB3]
AVDD: C9.2 C10.2 FB1.2 U2.8(AVDD)
OSCIN: C7.2 U2.14(OSCIN) Y1.1
OSCOUT: C8.2 U2.15(OSCOUT) Y1.3
RX: C19.1 R5.1 U2.10(RX)
TVDD: C16.2 C17.2 FB2.2 U2.5(TVDD)
VMID: C18.2 R5.2 U2.9(VMID)
NetC14_2: C14.2 U2.37(SVDD)
NetC19_2: C19.2 R6.2
NetC20_1: L2.2 ; port Antenna Match 1
NetC25_1: L3.2 R6.1 TP11.1 ; port Antenna Match 2
NetD2_1: D2.1(C) R3.1
NetL2_1: L2.1 U2.4(TX1)
NetL3_1: L3.1 U2.6(TX2)
NetMD1_29: U2.27(NSS) ; port NSS
NetMD1_30: U2.30(SCK) ; port SCK
NetMD1_31: U2.29(MISO) ; port MISO
NetMD1_37: U2.28(MOSI) ; port MOSI
NetR4_1: R4.1 U2.38(RSTPDN)

Not connected (* = marked no-connect by the designer): U2 2(LOADMOD)* 12(AUX1)* 13(AUX2)* 19(P35)* 20(NC)* 21(NC)* 22(NC)* 24(P30)* 25(IRQ)* 26(RSTOUTN)* 31(P31)* 32(P32_INT0)* 33(P33_INT1)* 34(P34)* 35(SIGOUT)* 36(SIGIN)*

### Notes on the sheet
- RFID Reader schematic
- 4
- 4 of 6
- B
- Sirimanna N.T.W.

### Library data of the parts
C7-C19 = CMP-2100-03644-1: Chip Capacitor, 0.1 uF, +/- 10%, 50 V, -55 to 125 degC, 0805 (2012 Metric), RoHS, Tape and Reel; Manufacturer: Murata; Voltage: 50V; Capacitance: 100nF; Insulation Resistance: 10GR; Dielectric Material: Ceramic; Dielectric: X7R; Package Description: 2-Pin Surface Mount Device, Body 2 x 1.25 mm; Manufacturer URL: http://www.murata.com/; Case Code (Imperial): 0805; Datasheet URL: http://psearch.en.murata.com/capacitor/product/GRM21BR71H104KA01%23.pdf; Termination: SMD/SMT; Lead Free: LeadFree; Package Quantity: 1; Mount: SurfaceMount; REACH SVHC: Unknown; Thickness: 0.053inch; Height: 1.25mm; Case/Package: 0805; Voltage Rating: 50V; Width: 0.049inch; Case Code (Metric): 2012; Material: Ceramic; Min Operating Temperature: -55degC; RoHSCompliant: true; Datasheet Version: 42675.0; Voltage Rating (DC): 50V; Tolerance: 10%; Package Reference: 0805; Depth: 1.25mm; Length: 2mm; Max Operating Temperature: 125degC; Packaging: TapeandReel; Number of Pins: 2; Radiation Hardening: No
D2 = CMP-00030-55433990-1: as D3 on sheet Outputs; Depth: 3.2mm; Wavelength: 575nm; Color: Green; Schedule B: 8541402000, 8541402000; RoHS: Compliant; Max Operating Temperature: 100°C; Power Dissipation: 20mW; Height: 4.5mm; Number of Pins: 2; Forward Voltage: 1.9V; NexarPartId: 55433990; Max Power Dissipation: 20mW; Length: 3.2mm; Forward Current: 2mA; Min Operating Temperature: -40°C; Illumination Color: Green; Lens Size: 3mm; Reverse Voltage: 20V; Mount: Through Hole; Case/Package: T; Radiation Hardening: No; Number of Elements: 1; REACH SVHC: Unknown; Lens Color: Green
FB1 FB2 = CMP-08257-000007-1: FERRITE BEAD 100 OHM 0805 1LN; Max Current Rating: 4A; Impedance: 100R; Tolerance: 25%; Test Frequency: 100MHz; DC Resistance (DCR): 20mR; Number of Lines: 1; Ratings: AEC-Q200; Height: 0.85mm; Length: 0.079inch; Max DC Current: 4A; Lead Free: Lead Free; Termination: SMD/SMT; Min Operating Temperature: -55°C; Mount: Surface Mount; Core Material: Ferrite; Packaging: Tape and Reel; Case Code (Imperial): 0805; Package Quantity: 4000; Depth: 1.25mm; Case/Package: 0805; Width: 1.25mm; Case Code (Metric): 2012; Max Operating Temperature: 125°C; Weight: 0.000194oz
L2 L3 = CMP-06042-016670-1: Multilayer Type Inductor for General Circuits, 0805 (2012), 0.56μH, 10%, 0.63Ω, 150mA; Core Material: Ferrite; Shielding: Shielded; Test Frequency: 25MHz; Q Factor: 25; DC Resistance (DCR): 630mR; Self Resonant Frequency: 140MHz; Military Standard: Not; Height: 0.85mm; Mount: Surface Mount; Radiation Hardening: No; Max DC Current: 150mA; Height - Seated (Max): 0.041inch; Lead Free: Lead Free; Width: 1.25mm; Case Code (Imperial): 0805; Packaging: Tape and Reel; Series: LQM21N; Tolerance: 10%; Termination: SMD/SMT; Case/Package: 0805; Case Code (Metric): 2012; Min Operating Temperature: -40°C; DC Current: 150mA; Max Operating Temperature: 85°C; Inductance: 560nH; Length: 2mm; Package Quantity: 4000; Current Rating: 150mA; Depth: 1.45mm; RoHS Compliant: Yes
R3 = CMP-2100-03670-1: as R11 on sheet Outputs; Number of Pins: 2; REACH SVHC: NoSVHC; Datasheet Version: Rev. 5, 10/2016; Max Operating Temperature: 155degC; Manufacturer URL: http://www.yageo.com/; Case Code (Imperial): 0805; Package Description: 2-Pin Surface Mounted Device, Body 2 x 1.25 mm; Case Code (Metric): 2012; Length: 2mm; RoHSCompliant: true; Max Power Dissipation: 125mW; Depth: 1.25mm; Packaging: TapeandReel; Height: 0.5mm; Package Reference: 0805; Package Quantity: 1; Tolerance: 1%; Termination: SMD/SMT; Min Operating Temperature: -55degC; Lead Free: LeadFree; Width: 1.25mm; Voltage Rating (DC): 150V; Datasheet URL: http://www.yageo.com/NewPortal/yageodocoutput?fileName=/pdf/R-Chip/PYu-RC_Group_51_RoHS_L_5.pdf; Composition: ThickFilm; Number of Terminations: 2; Case/Package: 0805
R4 = CMP-1659-00013-4: Chip Resistor, 10 KOhm, +/- 1%, 0.125 W, -55 to 155 degC, 0805 (2012 Metric), RoHS, Tape and Reel; Manufacturer: Yageo; Voltage Rating: 150 V; Mount: Surface Mount; ComponentLink1Description: Manufacturer URL; ComponentLink2URL: http://www.yageo.com/documents/recent/PYu-RC_Group_51_RoHS_L_04.pdf; Pins: 2; Length: 2 mm; Min Operating Temperature: -55 degC; Height: 0.5 mm; Mounting Technology: Surface Mount; RoHSCompliant: true; REACH SVHC: No SVHC; ComponentLink1URL: http://www.yageo.com/; Max Operating Temperature: 155 degC; PackageReference: 0805; DatasheetVersion: Rev. 4, 02/2016; Package Quantity: 5000; Packaging: Tape and Reel; ComponentLink2Description: Datasheet; PackageDescription: 2-Pin Surface Mounted Device, Body 2 x 1.25 mm
R5 = CMP-1013-00510-2: Part Number: CRCW08051K00FKEA; Manufacturer: Vishay Dale
R6 = CMP-2001-03615-2: RES Thick Film, 1.5kΩ, 1%, 0.125W, 100ppm/°C, 0805; Resistance: 1.5kR; Power Rating: 125mW; Voltage Rating: 150V; Features: Automotive AEC-Q200; Length: 2mm; Min Operating Temperature: -55°C; Width: 0.049inch; Tolerance: 1%; Temperature Coefficient: 100ppm/°C; Case Code (Imperial): 0805; Case Code (Metric): 2012; Package Quantity: 10; Number of Terminations: 2; Max Operating Temperature: 155°C; Military Standard: Not; Height: 0.45mm; Depth: 1.25mm; Lead Free: Lead Free; Packaging: Tape and Reel; Weight: 0.000194oz; Voltage Rating (DC): 150V; Composition: Thick Film; Radiation Hardening: No; Case/Package: 0805; Termination: SMD/SMT; Contact Plating: Tin; Max Power Dissipation: 125mW
TP11 = CMP-1672-00009-1: Test Point, Orange, 1-Pin THD, RoHS; Peak Reverse Current: 600 uA; Forward Current: 3 A; Max Surge Current: 80 A; Forward Voltage: 1.08 V; Max Operating Temperature: 150 degC; PackageReference: 5003; Pins: 2; ComponentLink2URL: http://keyelco.com/userAssets/file/M65p56.pdf; PackageDescription: 1-Pin Through Hole Device, Dia 2.54 mm; Weight: 0.01 lb; Diameter: 5.3 mm; Mount: Through Hole; Package Quantity: 500; Packaging: Bulk; Min Operating Temperature: -65 degC; ComponentLink1Description: Manufacturer URL; Height: 0.25 inch; ComponentLink1URL: http://www.keyelco.com/; ComponentLink2Description: Datasheet; Width: 0.25 inch; REACH SVHC: No SVHC; RoHSCompliant: true; Radiation Hardening: No; Length: 9.5 mm; DatasheetVersion: Jun-15
U2 = CMP-2000-05282-1: NFC Controller, 13.56 MHz, -30 to 85 degC, 40-Pin HVQFN (SOT618-1), RoHS, Tray; Manufacturer: NXP Semiconductors; Supply Voltage - Min: 2.7V; Supply Voltage - Max: 5.5V; Brand: NXPSemiconductors; Supply Current: 12uA; RoHS: Details; Mounting Style: SMD/SMT; Packaging: Tray; Operating Frequency: 13.56MHz; Maximum Operating Temperature: +85C; Product Category: RFWirelessMisc; Datasheet Version: Rev. 1.2, 03/2011; Type: NearFieldTransmissionModule,Read/Write; Package / Case: QFN-40; Datasheet URL: https://datasheet.ciiva.com/1172/1391932-1172875.pdf; Factory Pack Quantity: 490; Manufacturer URL: http://www.nxp.com/; Minimum Operating Temperature: -25C
Y1 = CMP-27762-000994-1: Crystal 27.12MHz ±30ppm 18pF SMD-4 3.2mm x 2.5mm; ESR (Equivalent Series Resistance): 50R; Frequency Stability: 50ppm; Capacitance: 1.8E-11F; Height: 0.031inch; Load Capacitance: 18pF; Width: 0.098inch; Packaging: Tape and Reel; Lead Free: Lead Free; Frequency Tolerance: 30ppm; Max Operating Temperature: 70°C; Length: 0.126inch; Case/Package: SMD/SMT; Mount: Surface Mount; Min Operating Temperature: -20°C; RoHS Compliant: Yes; Frequency: 27.12MHz

## Sheet Antenna_Matching_Circuit.SchDoc
size 297 x 209 mm; SheetNumber: 5; SheetTotal: 6
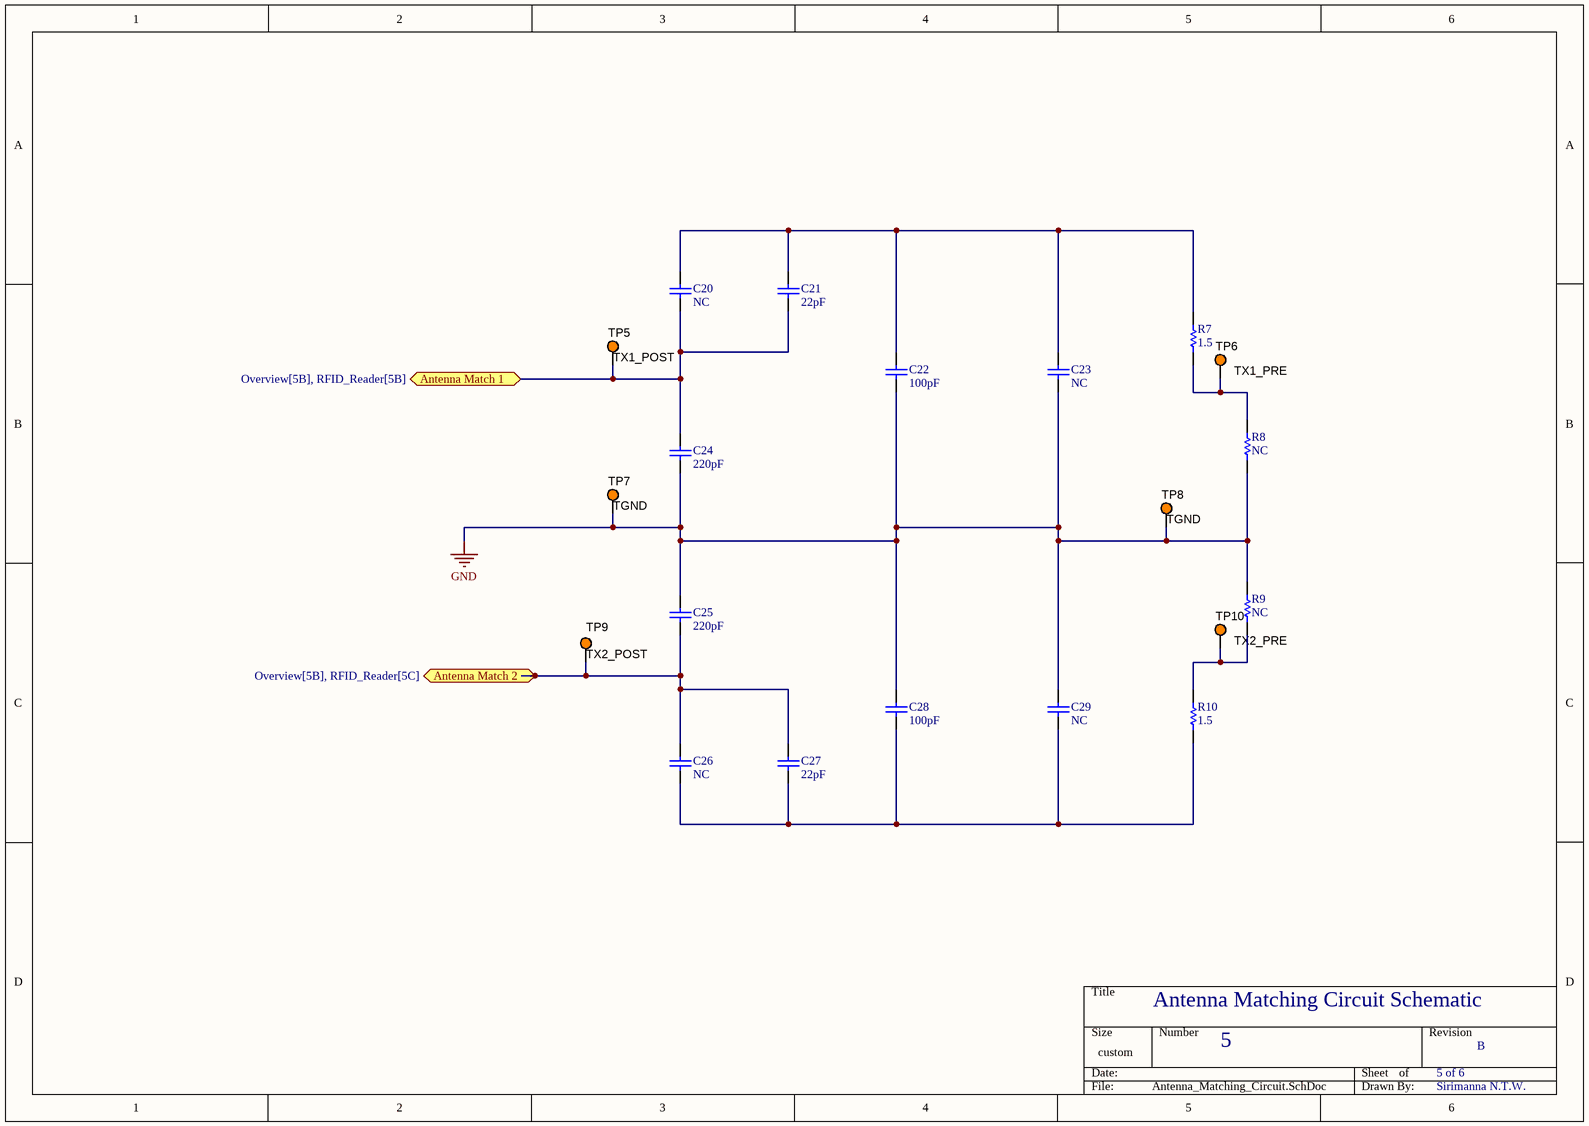
[diagram p5: Antenna_Matching_Circuit.SchDoc]

### Parts
C20  NC  [CAPC2013X135X45NL10T25]
C21  22pF  [CAPC2013X135X45NL10T25]
C22  100pF  [CAPC2013X135X45NL10T25]
C23  NC  [CAPC2013X135X45NL10T25]
C24  220pF  [CAPC2013X135X45NL10T25]
C25  220pF  [CAPC2013X135X45NL10T25]
C26  NC  [CAPC2013X135X45NL10T25]
C27  22pF  [CAPC2013X135X45NL10T25]
C28  100pF  [CAPC2013X135X45NL10T25]
C29  NC  [CAPC2013X135X45NL10T25]
R7  1.5  [RESC2013X70X40NL20T20]
R8  NC  [RESC1005X40X25NL05T05]
R9  NC  [RESC1005X40X25LL05T05]
R10  1.5  [RESC2013X70X40NL20T20]
TP5  TX1_POST  [KSTN-5003]
TP6  TX1_PRE  [KSTN-5003]
TP7  TGND  [KSTN-5003]
TP8  TGND  [KSTN-5003]
TP9  TX2_POST  [KSTN-5003]
TP10  TX2_PRE  [KSTN-5003]

### Ports
Antenna Match 1 (bidir, see Overview[5B], RFID_Reader[5B]), Antenna Match 2 (bidir, see Overview[5B], RFID_Reader[5C])

### Nets
GND: C22.1 C23.1 C24.1 C25.2 C28.2 C29.2 R8.2 R9.1 TP7.1 TP8.1
NetC20_1: C20.1 C21.1 C24.2 TP5.1 ; port Antenna Match 1
NetC20_2: C20.2 C21.2 C22.2 C23.2 R7.1
NetC25_1: C25.1 C26.2 C27.2 TP9.1 ; port Antenna Match 2
NetC26_1: C26.1 C27.1 C28.1 C29.1 R10.2
NetR7_2: R7.2 R8.1 TP6.1
NetR9_2: R9.2 R10.1 TP10.1

### Notes on the sheet
- Antenna Matching Circuit Schematic
- 5
- 5 of 6
- B
- Sirimanna N.T.W.

### Library data of the parts
C20-C29 = CMP-2100-03644-1: as C7 on sheet RFID_Reader; Package Description: 2-Pin Surface Mount Device, Body 2 x 1.25 mm; Manufacturer URL: http://www.murata.com/; Case Code (Imperial): 0805; Datasheet URL: http://psearch.en.murata.com/capacitor/product/GRM21BR71H104KA01%23.pdf; Termination: SMD/SMT; Lead Free: LeadFree; Package Quantity: 1; Mount: SurfaceMount; REACH SVHC: Unknown; Thickness: 0.053inch; Height: 1.25mm; Case/Package: 0805; Voltage Rating: 50V; Width: 0.049inch; Case Code (Metric): 2012; Material: Ceramic; Min Operating Temperature: -55degC; RoHSCompliant: true; Datasheet Version: 42675.0; Voltage Rating (DC): 50V; Tolerance: 10%; Package Reference: 0805; Depth: 1.25mm; Length: 2mm; Max Operating Temperature: 125degC; Packaging: TapeandReel; Number of Pins: 2; Radiation Hardening: No
R7 R10 = CMP-2001-00490-1: Part Number: ERJ6BQF1R5V; Manufacturer: Panasonic
R8 R9 = CMP-2002-08382-1: Manufacturer: Vishay Dale; Part Number: CRCW040222R0FKED
TP5-TP10 = CMP-1672-00009-1: as TP11 on sheet RFID_Reader; Max Operating Temperature: 150 degC; PackageReference: 5003; Pins: 2; ComponentLink2URL: http://keyelco.com/userAssets/file/M65p56.pdf; PackageDescription: 1-Pin Through Hole Device, Dia 2.54 mm; Weight: 0.01 lb; Diameter: 5.3 mm; Mount: Through Hole; Package Quantity: 500; Packaging: Bulk; Min Operating Temperature: -65 degC; ComponentLink1Description: Manufacturer URL; Height: 0.25 inch; ComponentLink1URL: http://www.keyelco.com/; ComponentLink2Description: Datasheet; Width: 0.25 inch; REACH SVHC: No SVHC; RoHSCompliant: true; Radiation Hardening: No; Length: 9.5 mm; DatasheetVersion: Jun-15

## Nets that join several sheets
FB3: Power_Circuit (5 pins), ESP32-WROOM-32 (C3.2 C4.2 MD1.2 R2.1), Outputs (D4.1 LS1.1), RFID_Reader (7 pins)
GND: Power_Circuit (9 pins), ESP32-WROOM-32 (11 pins), Outputs (Q1.2 R11.2), RFID_Reader (22 pins), Antenna_Matching_Circuit (10 pins)
NetC20_1: RFID_Reader (L2.2), Antenna_Matching_Circuit (C20.1 C21.1 C24.2 TP5.1)
NetC25_1: RFID_Reader (L3.2 R6.1 TP11.1), Antenna_Matching_Circuit (C25.1 C26.2 C27.2 TP9.1)
NetD3_2: ESP32-WROOM-32 (MD1.16), Outputs (D3.2)
NetMD1_13: ESP32-WROOM-32 (MD1.13), Outputs (R12.1)
NetMD1_29: ESP32-WROOM-32 (MD1.29), RFID_Reader (U2.27)
NetMD1_30: ESP32-WROOM-32 (MD1.30), RFID_Reader (U2.30)
NetMD1_31: ESP32-WROOM-32 (MD1.31), RFID_Reader (U2.29)
NetMD1_37: ESP32-WROOM-32 (MD1.37), RFID_Reader (U2.28)